# Altium schematic sheet P15 AHD & USBCAM.SchDoc
size 420 x 297 mm
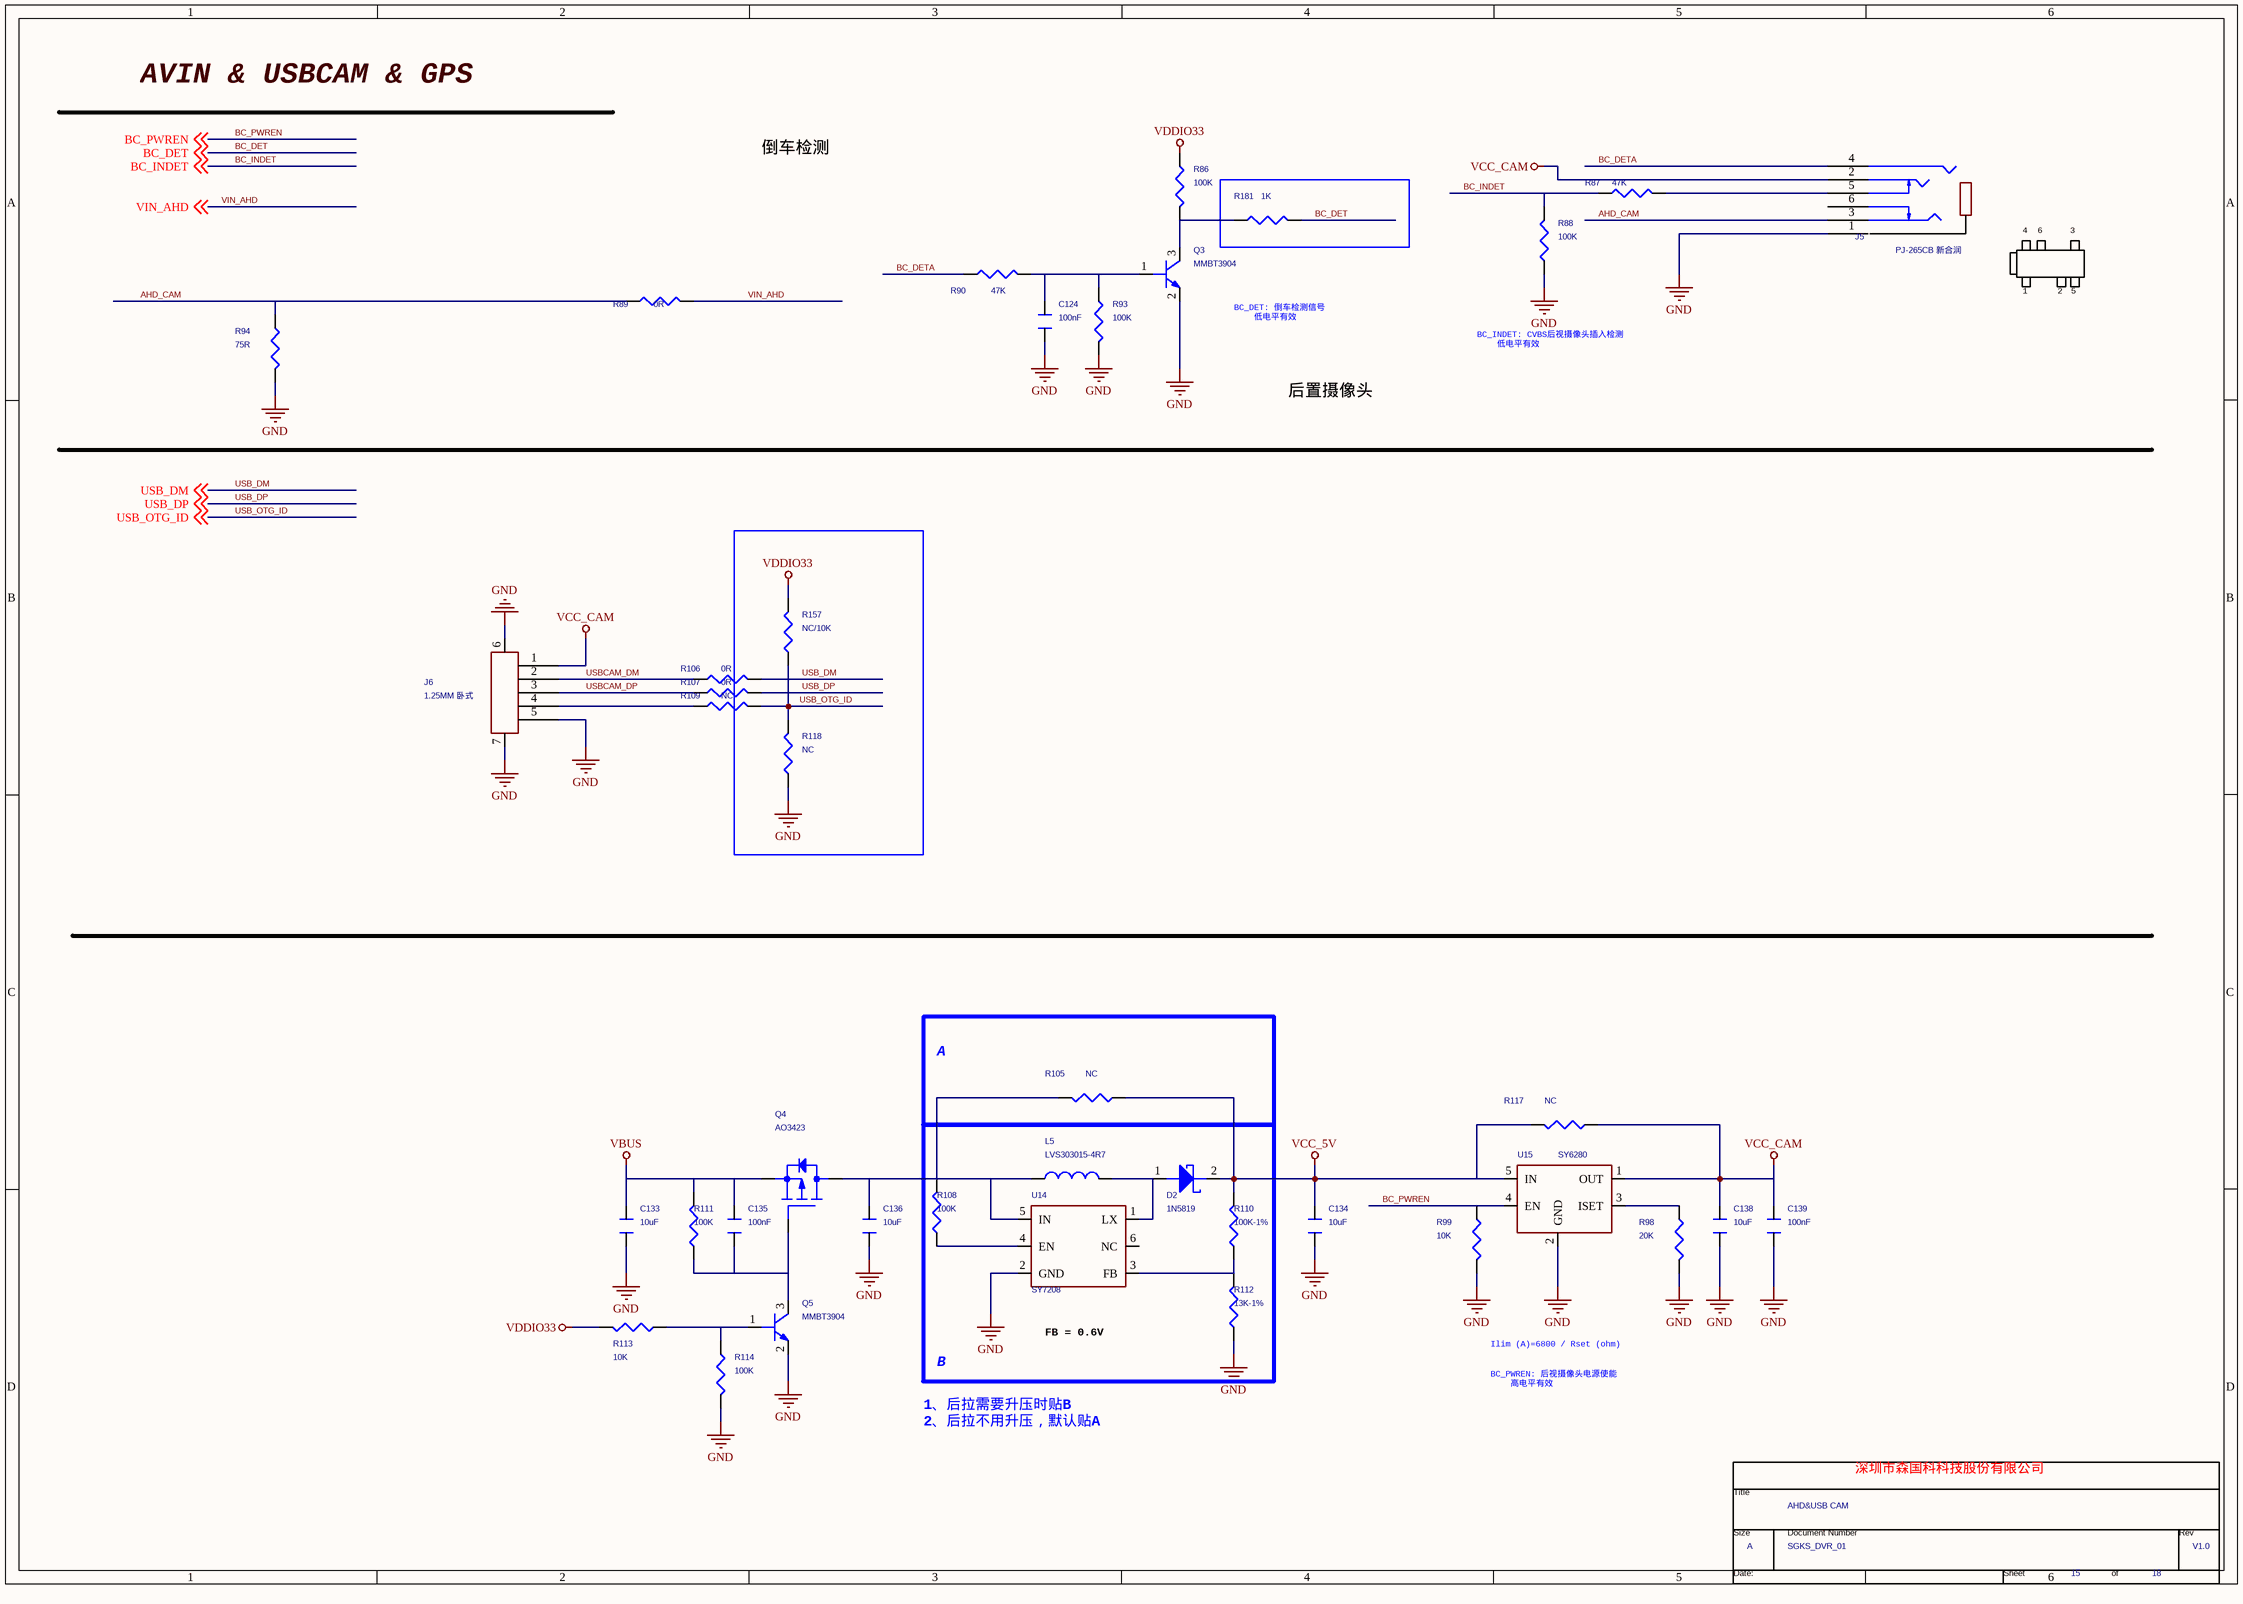
[diagram p0: P15 AHD & USBCAM.SchDoc]

## Parts
*  Page Count: 18  Page Number: 15  Page Size: A  Title: AHD&USB CAM  RevCode: V1.0  Doc: SGKS_DVR_01  (hidden comment: TitleBlock0)  (graphical)
C124  100nF  [C0402]
C133  10uF  [C0603]
C134  10uF  [C0603]
C135  100nF  [C0402]
C136  10uF  [C0603]
C138  10uF  [C0603]
C139  100nF  [C0402]
D2  1N5819  [SOD123]
J5  PJ-265CB 新合润  [TSH-3865D]
J6  1.25MM 卧式  [CON_5P_1.25]
L5  LVS303015-4R7  [PL4X4]
Q3  MMBT3904  [SOT-23]
Q4  AO3423  [SOT-23]
Q5  MMBT3904  [SOT-23]
R86  100K  [R0603/SMD]
R87  47K  [R0603/SMD]
R88  100K  [R0603/SMD]
R89  0R  [R0402]
R90  47K  [R0603/SMD]
R93  100K  [R0603/SMD]
R94  75R  [R0402]
R98  20K  [R0402]
R99  10K  [R0402]
R105  NC  [R0603/SMD]
R106  0R  [R0603/SMD]
R107  0R  [R0603/SMD]
R108  100K  [R0603/SMD]
R109  NC  [R0603/SMD]
R110  100K-1%  [R0603/SMD]
R111  100K  [R0603/SMD]
R112  13K-1%  [R0603/SMD]
R113  10K  [R0603/SMD]
R114  100K  [R0603/SMD]
R117  NC  [R0603/SMD]
R118  NC  [R0603/SMD]
R157  NC/10K  [R0603/SMD]
R181  1K  [R0603/SMD]
U14  SY7208  [SOT23-6]
U15  SY6280  [SOT23-6]

## Blocks framed on the sheet
A: R105
B: D2 L5 R108 R110 R112 U14

## Nets
GND: C124.1 C133.1 C134.1 C136.1 C138.1 C139.1 J5.1 J6.5 J6.6 J6.7 Q3.2(E) Q5.2(E) R88.1 R93.2 R94.2 R98.2 R99.2 R112.1 R114.2 R118.1 U14.2(GND) U15.2(GND)
VBUS: C133.2 C135.2 Q4.2(SOURCE) R111.2
VCC_5V: C134.2 D2.2 R105.1 R110.2 R117.2 U15.5(IN)
VCC_CAM: C138.2 C139.2 J5.2 J6.1 R117.1 U15.1(OUT)
VDDIO33: R86.1 R113.2 R157.2
AHD_CAM: J5.3 R89.1 R94.1
BC_DET: R181.2 ; off-sheet BC_DET
BC_DETA: J5.4 R90.1
BC_INDET: R87.1 R88.2 ; off-sheet BC_INDET
BC_PWREN: R99.1 U15.4(EN) ; off-sheet BC_PWREN
USB_DM: R106.2 ; off-sheet USB_DM
USB_DP: R107.2 ; off-sheet USB_DP
USB_OTG_ID: R109.2 R118.2 R157.1 ; off-sheet USB_OTG_ID
USBCAM_DM: J6.2 R106.1
USBCAM_DP: J6.3 R107.1
VIN_AHD: R89.2 ; off-sheet VIN_AHD
NetC124_2: C124.2 Q3.1(B) R90.2 R93.1
NetC135_1: C135.1 Q4.1(GATE) Q5.3(C) R111.1
NetC136_2: C136.2 L5.1 Q4.3(DRAIN) R105.2 R108.2 U14.5(IN)
NetD2_1: D2.1 L5.2 U14.1(LX)
NetJ5_5: J5.5 R87.2
NetJ6_4: J6.4 R109.1
NetQ3_3: Q3.3(C) R86.2 R181.1
NetQ5_1: Q5.1(B) R113.1 R114.1
NetR98_1: R98.1 U15.3(ISET)
NetR108_1: R108.1 U14.4(EN)
NetR110_1: R110.1 R112.2 U14.3(FB)

Not connected (* = marked no-connect by the designer): J5 6; U14 6(NC)

## Notes on the sheet
- AVIN & USBCAM & GPS
- 倒车检测
- 4
- 6
- 3
- BC_DET: 倒车检测信号
  低电平有效
- BC_INDET: CVBS后视摄像头插入检测
  低电平有效
- 1
- 2
- 5
- 后置摄像头
- FB = 0.6V
- 1、后拉需要升压时贴B
  2、后拉不用升压，默认贴A
- BC_PWREN: 后视摄像头电源使能
  高电平有效
- Ilim (A)=6800 / Rset (ohm)
- 深圳市森国科科技股份有限公司
- (in symbol TitleBlock0) Title; Size; Document Number; Rev; Date:; Sheet; of

## Library data of the parts
C124 C133 C135 C136 C138 C139 = CAPACITOR: PAGE: 1
C134 = CAPACITOR_0: PAGE: 1
D2 = DIODE_SCHOTTKY_0
J5 = PHONOJACK_0
J6 = CON3_2
L5 = INDUCTOR_Dup1
Q3 Q5 = NPN
Q4 = PMOS
R86-R88 R90 R93 R105-R114 R117 R118 R157 R181 = RES/SMD_1: Part Description: Chip Resistor; Type: 贴片电阻
R89 R94 R98 R99 = RESISTOR: ROOM: TVLCD
U14 = RT9266PE_3
U15 = RT9266PE_1: Page: 9
* = TitleBlock0: Page Create Date: March  8, 1995